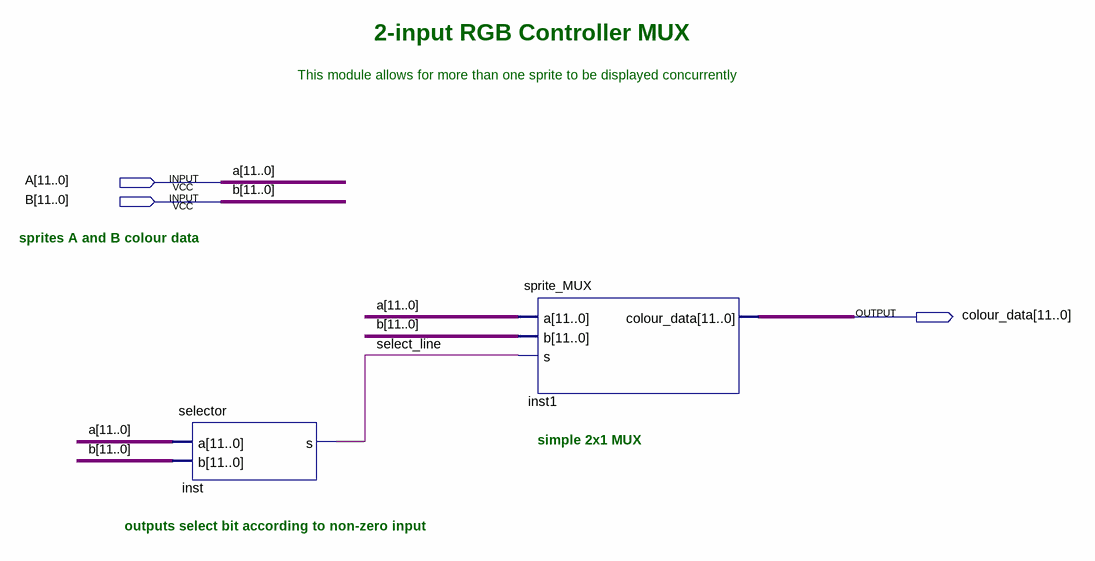
[diagram p0: schematic sheet]
// Quartus schematic rgbMUX.bdf as structural Verilog: 2 symbols, 3 pins
module rgbMUX (
  input  [11:0] A,
  input  [11:0] B,
  output [11:0] colour_data
);

  wire select_line;

  selector inst (.a(A), .b(B), .s(select_line));
  sprite_MUX inst1 (.a(A), .b(B), .s(select_line), .colour_data(colour_data));

  // Notes on the sheet:
  //   2-input RGB Controller MUX
  //   This module allows for more than one sprite to be displayed concurrently
  //   sprites A and B colour data
  //   simple 2x1 MUX
  //   outputs select bit according to non-zero input
endmodule
